# EAGLE board Schaltplan V1.0 (EAGLE 9.6.2)
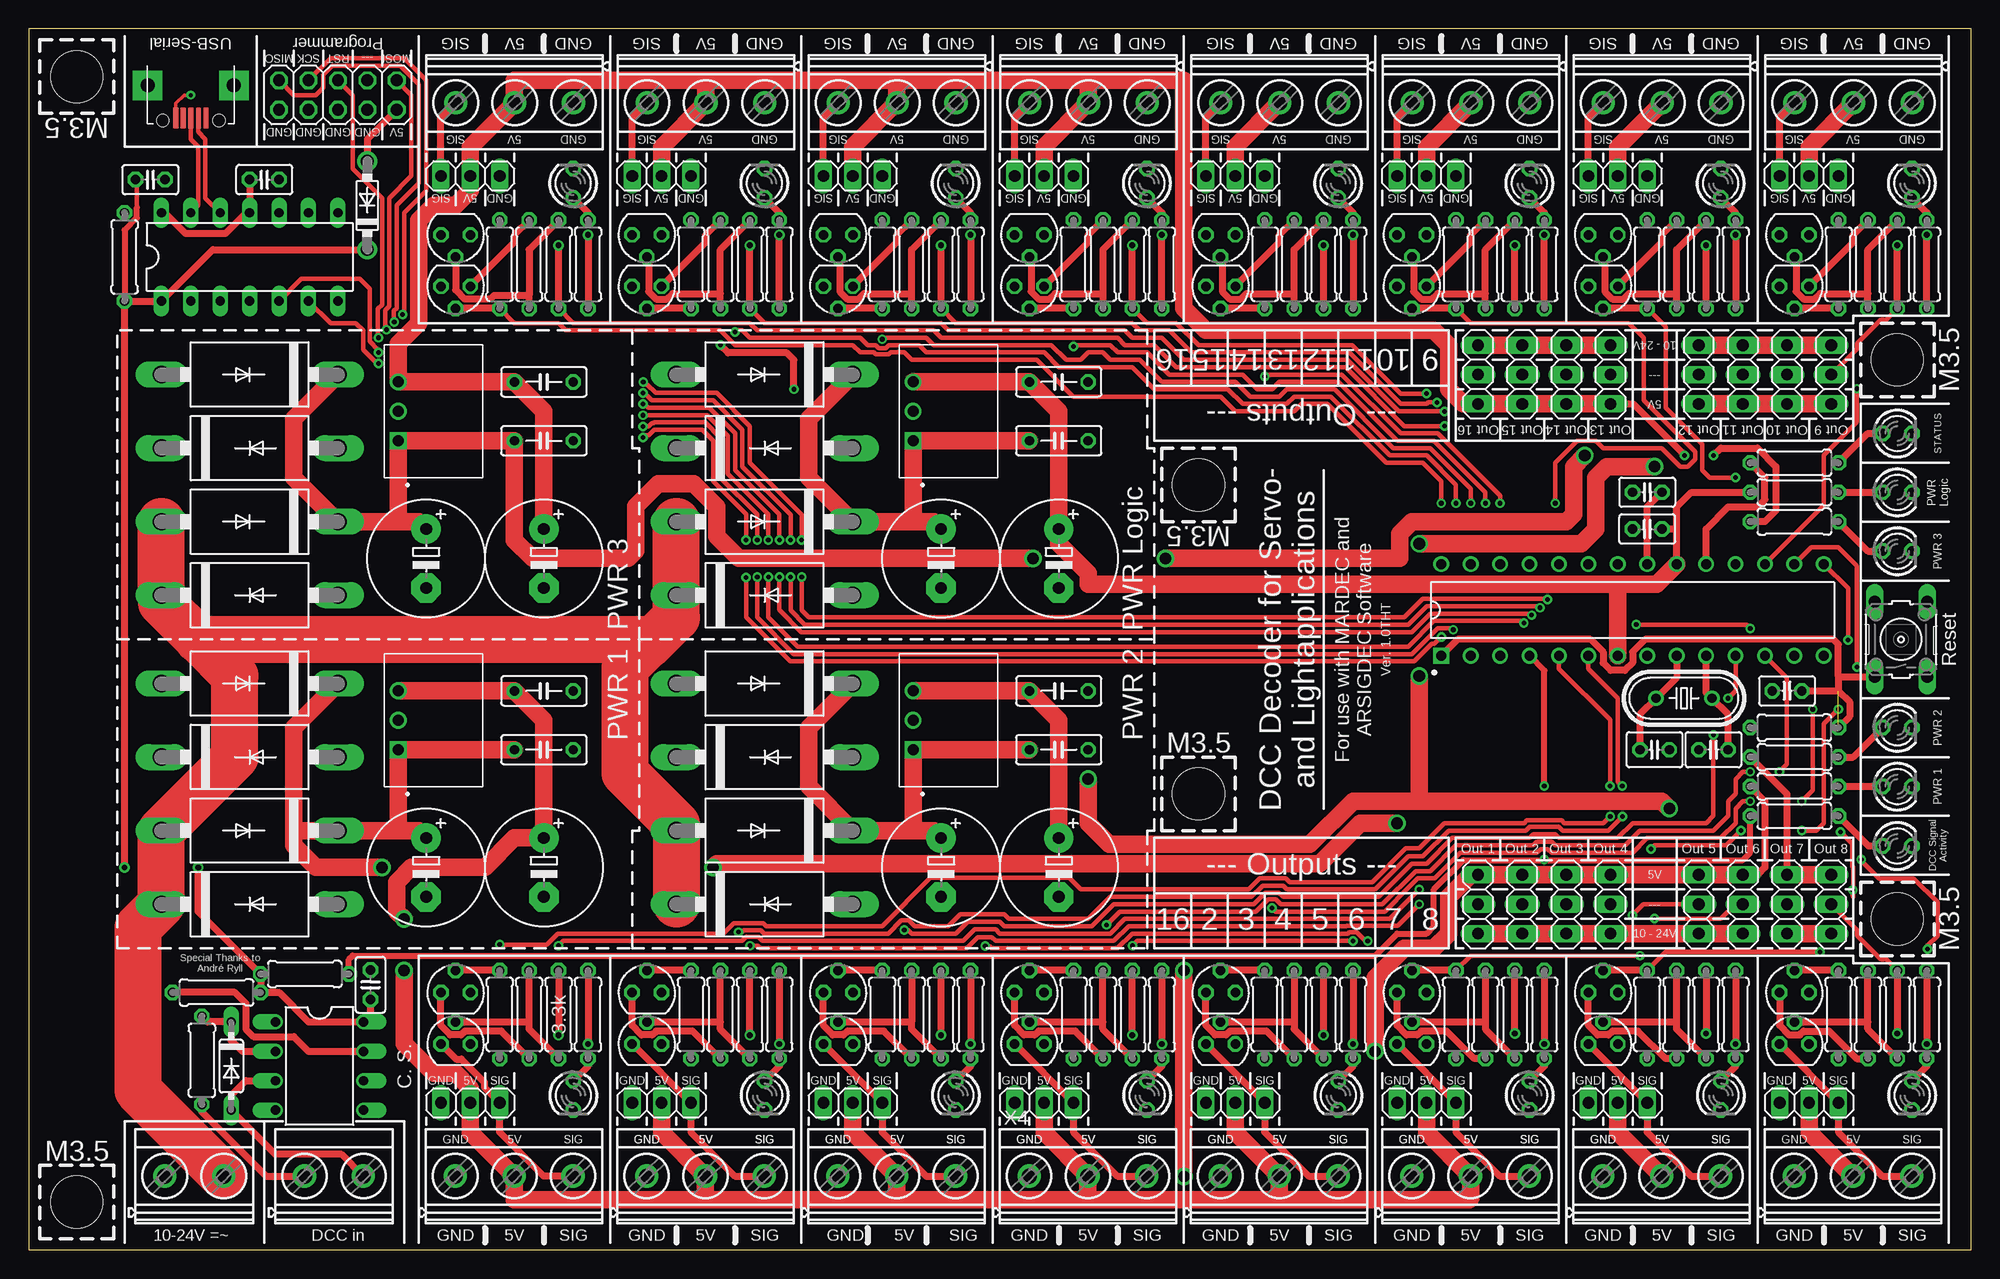
[diagram p1: board, top side]
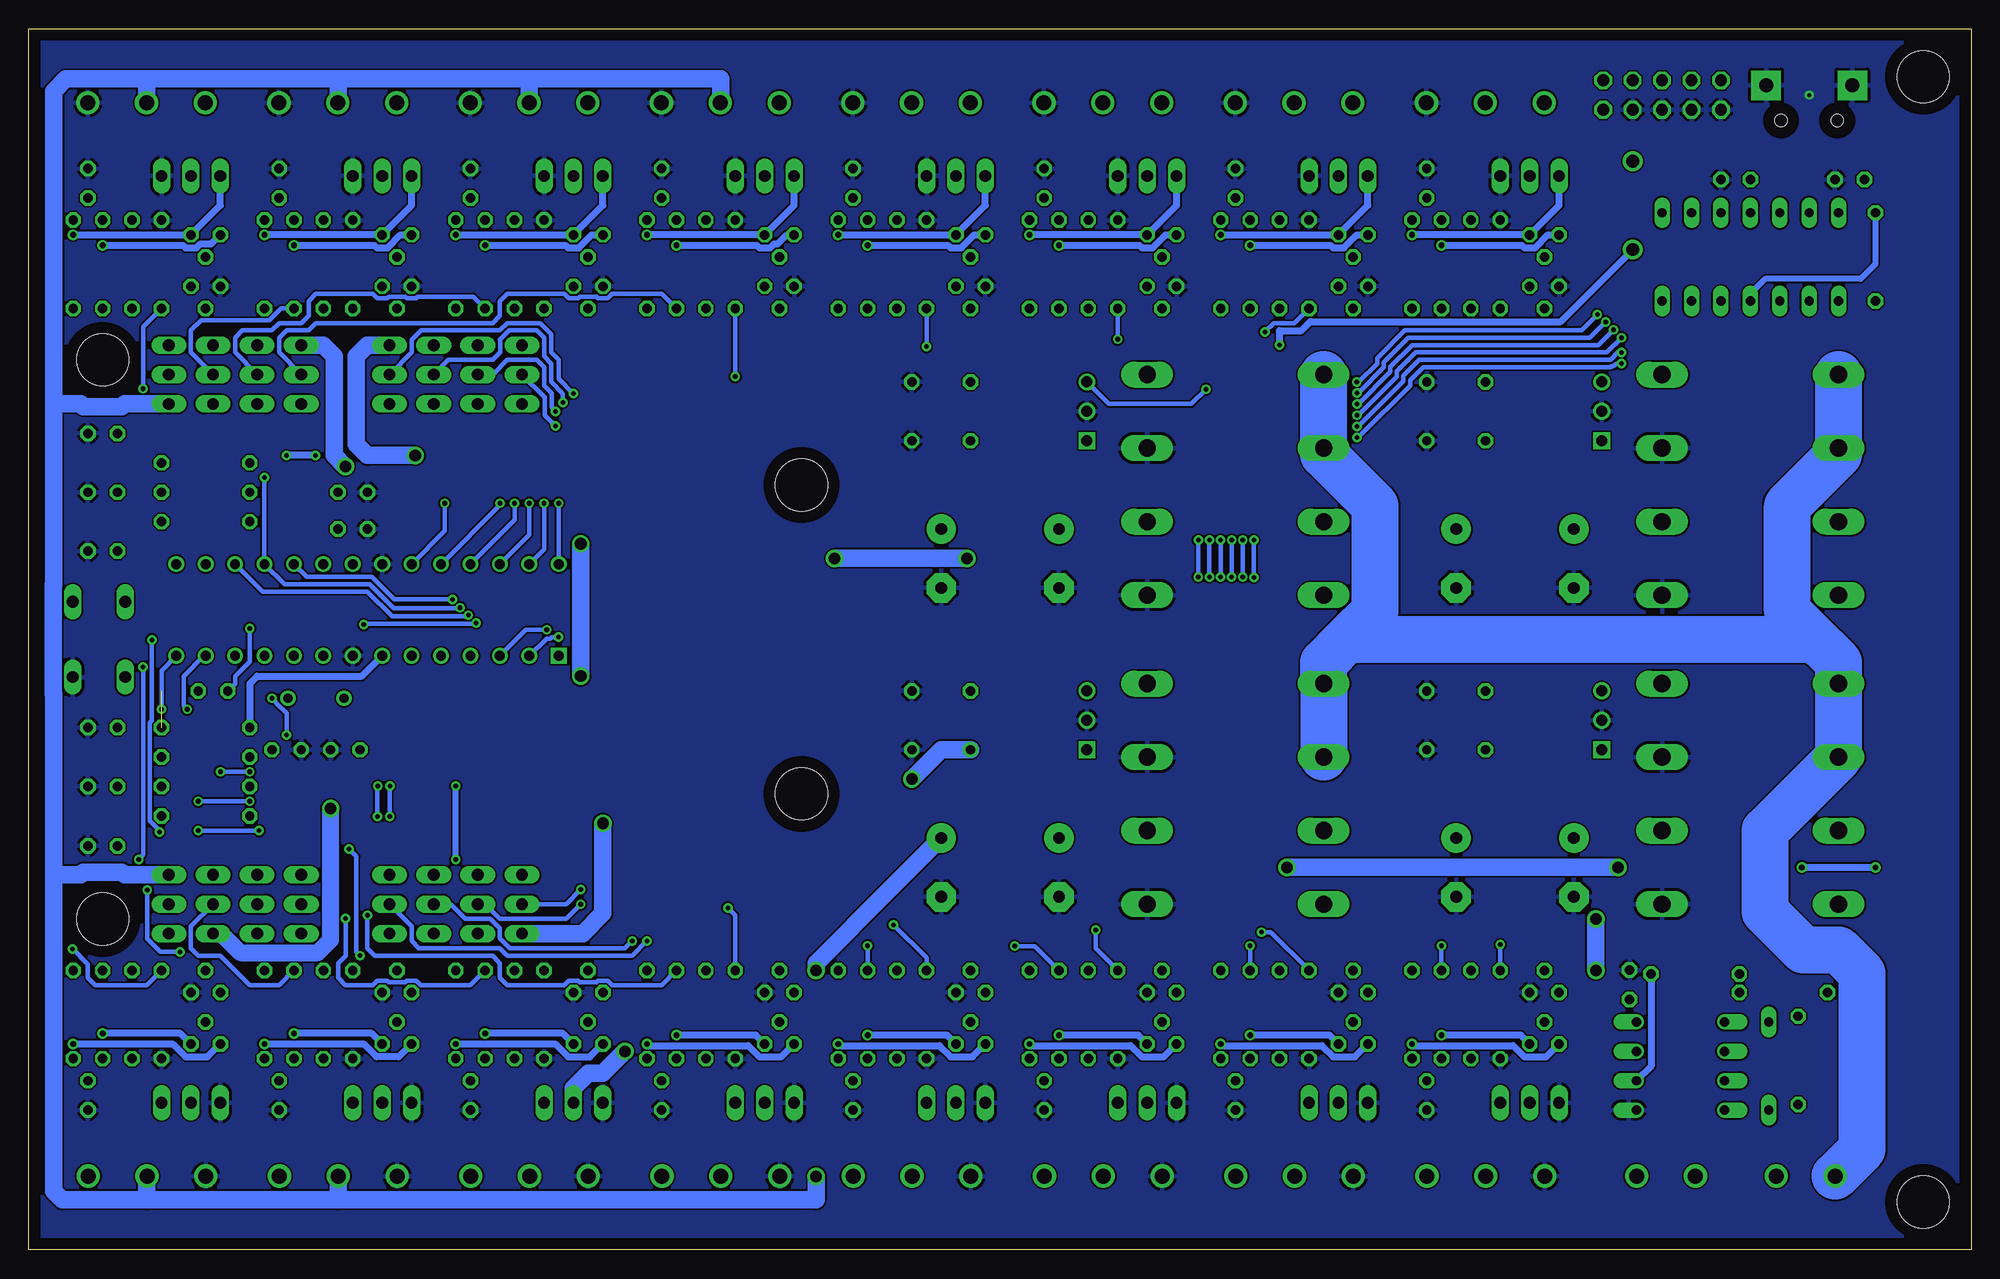
[diagram p2: board, bottom side, seen from below]

Size 167.65 x 105.4 mm. Coordinates in mm from the lower left corner, seen from the top.
Outline: 0,0 167.65,0 167.65,105.4 0,105.4 0,0
Copper layers (1*16): Top 0.07mm / dielectric 0.4mm / Bottom 0.07mm
Design rules "default *": minimum track width 6mil, minimum drill 0.35mm, track to track 6mil, track to pad 6mil, pad to pad 6mil, via to via 6mil, smd to smd 6mil, copper to edge 40mil, drill to drill 6mil, minimum pad ring 10mil, minimum via ring 8mil, stop-mask expansion 4mil, vias tented up to drill 0mil, thermal gap 10mil
Holes 4.5 mm at 161.29,76.83 161.29,28.57 100.96,39.37 100.96,66.04 4.13,101.28 4.13,4.13

## Footprints (pad centres in the part's own frame; a part is rotated, then mirrored left to right if it is on the bottom)
0207/7 = drill 0.813 octagon: 1 -3.81,0; 2 3.81,0
C050-025X075 = drill 0.813 octagon: 1 -2.54,0; 2 2.54,0
C025-025X050 = drill 0.813 octagon: 1 -1.27,0; 2 1.27,0
C025-030X050 = drill 0.813 octagon: 1 -1.27,0; 2 1.27,0
E5-10,5 = drill 1.016 pad 2.54: + -2.54,0 | drill 1.016 pad 2.54 octagon: - 2.54,0
DO201-15 = drill 1.499 long: A 7.62,0; C -7.62,0
DO35-7 = drill 0.813 long: A 3.81,0; C -3.81,0
DO41-7.6 = drill 1.1 pad 1.7: A 3.81,0; C -3.81,0
MKDSN1,5/2-5,08 = drill 1.3 pad 2: 1 -2.561,0.025; 2 2.519,0.025
DIL14 = drill 0.813 long: 1 -7.62,-3.81; 2 -5.08,-3.81; 3 -2.54,-3.81; 4 0,-3.81; 5 2.54,-3.81; 6 5.08,-3.81; 7 7.62,-3.81; 8 7.62,3.81; 9 5.08,3.81; 10 2.54,3.81; 11 0,3.81; 12 -2.54,3.81; 13 -5.08,3.81; 14 -7.62,3.81
1X03 = drill 1.016 long: 1 -2.54,0; 2 0,0; 3 2.54,0
LED3MM = drill 0.813 octagon: A -1.27,0; K 1.27,0
DIL08 = drill 0.813 offset: 1 -3.81,-3.81; 2 -1.27,-3.81; 3 1.27,-3.81; 4 3.81,-3.81; 5 3.81,3.81; 6 1.27,3.81; 7 -1.27,3.81; 8 -3.81,3.81
2X05 = drill 1.016 octagon: 1 -5.08,-1.27; 2 -5.08,1.27; 3 -2.54,-1.27; 4 -2.54,1.27; 5 0,-1.27; 6 0,1.27; 7 2.54,-1.27; 8 2.54,1.27; 9 5.08,-1.27; 10 5.08,1.27
CONV_R-78B5.0-2.0 = drill 0.94 square: 1 -2.54,3.05 | drill 0.94: 2 0,3.05; 3 2.54,3.05
HC49U-V = drill 0.813: 1 -2.413,0; 2 2.413,0
SOT54E = drill 0.813 octagon: D -1.27,0; G 0,1.905; S 1.27,0
B3F-10XX = drill 1.016 long: 1 -3.251,2.261; 2 3.251,2.261; 3 -3.251,-2.261; 4 3.251,-2.261
DIP794W46P254L2967H457Q28B = drill 0.85 square: 1 -3.96,16.51 | drill 0.85: 2 -3.96,13.97; 3 -3.96,11.43; 4 -3.96,8.89; 5 -3.96,6.35; 6 -3.96,3.81; 7 -3.96,1.27; 8 -3.96,-1.27; 9 -3.96,-3.81; 10 -3.96,-6.35; 11 -3.96,-8.89; 12 -3.96,-11.43; 13 -3.96,-13.97; 14 -3.96,-16.51; 15 3.96,-16.51; 16 3.96,-13.97; 17 3.96,-11.43; 18 3.96,-8.89; 19 3.96,-6.35; 20 3.96,-3.81; 21 3.96,-1.27; 22 3.96,1.27; 23 3.96,3.81; 24 3.96,6.35; 25 3.96,8.89; 26 3.96,11.43; 27 3.96,13.97; 28 3.96,16.51
MICRO-USB = smd 0.4 x 1.75: 1 -1.3,4.525; 2 -0.65,4.525; 3 0,4.525; 4 0.65,4.525; 5 1.3,4.525 | drill 1.2 pad 2.54 square: GND1 -3.725,1.7; GND2 3.725,1.7 | hole 1.05: -2.425,4.73; 2.425,4.73
MKDSN1,5/3-5,08 = drill 1.3 pad 2: 1 -7.641,0.025; 2 -2.561,0.025; 3 2.519,0.025

## Placement (x,y rotation side)
3,3K  3.3k  [0207/7]  45.72,20.32 90 top
3,3K1  3.3k  [0207/7]  62.23,20.32 90 top
3,3K2  3.3k  [0207/7]  78.74,20.32 90 top
3,3K3  3.3k  [0207/7]  95.25,20.32 90 top
3,3K4  3.3k  [0207/7]  111.76,20.32 90 top
3,3K5  3.3k  [0207/7]  128.27,20.32 90 top
3,3K6  3.3k  [0207/7]  144.78,20.32 90 top
3,3K7  3.3k  [0207/7]  161.29,20.32 90 top
3,3K8  3.3k  [0207/7]  161.29,85.09 270 top
3,3K9  3.3k  [0207/7]  144.78,85.09 270 top
3,3K10  3.3k  [0207/7]  128.27,85.09 270 top
3,3K11  3.3k  [0207/7]  111.76,85.09 270 top
3,3K12  3.3k  [0207/7]  95.25,85.09 270 top
3,3K13  3.3k  [0207/7]  78.74,85.09 270 top
3,3K14  3.3k  [0207/7]  62.23,85.09 270 top
3,3K15  3.3k  [0207/7]  45.72,85.09 270 top
C1  1uF  [C050-025X075]  44.45,48.26 180 top
C2  1uF  [C050-025X075]  44.45,43.18 180 top
C3  100nF  [C025-025X050]  29.48,22.89 90 top
C4  1uF  [C050-025X075]  88.9,48.26 180 top
C5  1uF  [C050-025X075]  88.9,43.18 180 top
C6  1uF  [C050-025X075]  44.45,74.93 180 top
C7  1uF  [C050-025X075]  44.45,69.85 180 top
C8  1uF  [C050-025X075]  88.9,74.93 180 top
C9  1uF  [C050-025X075]  88.9,69.85 180 top
C10  100nF  [C025-025X050]  151.76,48.26 0 top
C11  100nF  [C025-025X050]  139.7,65.41 0 top
C12  330nF  [C025-025X050]  20.32,92.39 180 top
C13  100nF  [C025-025X050]  10.48,92.39 0 top
C14  22pF  [C025-030X050]  145.41,43.18 0 top
C15  22pF  [C025-030X050]  140.34,43.18 180 top
C16  470uF  [E5-10,5]  78.74,59.69 270 top
C17  470uF  [E5-10,5]  88.9,59.69 270 top
C18  470uF  [E5-10,5]  44.45,33.02 270 top
C19  470uF  [E5-10,5]  88.9,33.02 270 top
C20  470uF  [E5-10,5]  34.29,33.02 270 top
C21  470uF  [E5-10,5]  78.74,33.02 270 top
C22  470uF  [E5-10,5]  44.45,59.69 270 top
C23  470uF  [E5-10,5]  34.29,59.69 270 top
C24  100nF  [C025-025X050]  139.7,62.23 180 top
D1  1N5400  [DO201-15]  19.05,48.89 180 top
D2  1N5400  [DO201-15]  19.05,42.54 0 top
D3  1N5400  [DO201-15]  19.05,36.2 180 top
D4  1N5400  [DO201-15]  19.05,29.85 0 top
D5  1N4148  [DO35-7]  17.46,15.88 270 top
D6  1N5400  [DO201-15]  63.5,36.2 180 top
D7  1N5400  [DO201-15]  63.5,29.85 0 top
D8  1N5400  [DO201-15]  63.5,48.89 180 top
D9  1N5400  [DO201-15]  63.5,42.54 0 top
D10  1N5400  [DO201-15]  19.05,75.56 180 top
D11  1N5400  [DO201-15]  19.05,69.22 0 top
D12  1N5400  [DO201-15]  19.05,62.86 180 top
D13  1N5400  [DO201-15]  19.05,56.52 0 top
D14  1N5400  [DO201-15]  63.5,75.56 180 top
D15  1N5400  [DO201-15]  63.5,69.22 0 top
D16  1N5400  [DO201-15]  63.5,62.86 180 top
D17  1N5400  [DO201-15]  63.5,56.52 0 top
D19  1N5817-B  [DO41-7.6]  29.21,90.17 90 top
DCC_IN  [MKDSN1,5/2-5,08]  26.35,6.35 0 top
IC1  MCP2221  [DIL14]  19.05,85.72 0 top
JP1  [1X03]  54.61,12.7 0 top
JP2  [1X03]  128.91,29.85 90 top
JP3  [1X03]  38.1,12.7 0 top
JP4  [1X03]  125.09,29.85 90 top
JP5  [1X03]  71.12,12.7 0 top
JP6  [1X03]  132.72,29.85 90 top
JP7  [1X03]  87.63,12.7 0 top
JP8  [1X03]  136.53,29.85 90 top
JP9  [1X03]  104.14,12.7 0 top
JP10  [1X03]  144.14,29.85 90 top
JP11  [1X03]  120.65,12.7 0 top
JP12  [1X03]  147.95,29.85 90 top
JP13  [1X03]  137.16,12.7 0 top
JP14  [1X03]  151.76,29.85 90 top
JP15  [1X03]  153.67,12.7 0 top
JP16  [1X03]  155.57,29.85 90 top
JP17  [1X03]  153.67,92.71 180 top
JP18  [1X03]  155.57,75.56 270 top
JP19  [1X03]  137.16,92.71 180 top
JP20  [1X03]  151.76,75.56 270 top
JP21  [1X03]  120.65,92.71 180 top
JP22  [1X03]  147.95,75.56 270 top
JP23  [1X03]  104.14,92.71 180 top
JP24  [1X03]  144.14,75.56 270 top
JP25  [1X03]  87.63,92.71 180 top
JP26  [1X03]  136.53,75.56 270 top
JP27  [1X03]  71.12,92.71 180 top
JP28  [1X03]  132.72,75.56 270 top
JP29  [1X03]  54.61,92.71 180 top
JP30  [1X03]  128.91,75.56 270 top
JP31  [1X03]  38.1,92.71 180 top
JP32  [1X03]  125.09,75.56 270 top
LED1  ROT  [LED3MM]  161.29,40 0 top
LED2  ROT  [LED3MM]  46.99,13.34 270 top
LED3  ROT  [LED3MM]  63.5,13.34 270 top
LED4  ROT  [LED3MM]  80.01,13.34 270 top
LED5  ROT  [LED3MM]  96.52,13.34 270 top
LED6  ROT  [LED3MM]  113.03,13.34 270 top
LED7  ROT  [LED3MM]  129.54,13.34 270 top
LED8  ROT  [LED3MM]  146.05,13.34 270 top
LED9  ROT  [LED3MM]  162.56,13.34 270 top
LED10  ROT  [LED3MM]  162.56,92.08 90 top
LED11  ROT  [LED3MM]  146.05,92.08 90 top
LED12  ROT  [LED3MM]  129.54,92.08 90 top
LED13  ROT  [LED3MM]  113.03,92.08 90 top
LED14  ROT  [LED3MM]  96.52,92.08 90 top
LED15  ROT  [LED3MM]  80.01,92.08 90 top
LED16  ROT  [LED3MM]  63.5,92.08 90 top
LED17  ROT  [LED3MM]  46.99,92.08 90 top
LED18  ROT  [LED3MM]  161.29,45.08 0 top
LED19  ROT  [LED3MM]  161.29,60.32 0 top
LED20  ROT  [LED3MM]  161.29,65.41 0 top
LED21  GRÜN  [LED3MM]  161.29,70.48 0 top
LED22  GELB  [LED3MM]  161.29,34.88 0 top
OK1  6N137  [DIL08]  25.08,15.88 270 top
POWER_IN  10-24V  [MKDSN1,5/2-5,08]  14.29,6.35 0 top
PRG_HEADER  [2X05]  26.67,99.69 180 top
PS1  R-78B5.0-2.0  [CONV_R-78B5.0-2.0]  79.38,72.39 90 top
PS2  R-78B5.0-2.0  [CONV_R-78B5.0-2.0]  34.92,45.72 90 top
PS3  R-78B5.0-2.0  [CONV_R-78B5.0-2.0]  79.38,45.72 90 top
PS4  R-78B5.0-2.0  [CONV_R-78B5.0-2.0]  34.92,72.39 90 top
Q1  16Mhz  [HC49U-V]  142.88,47.62 180 top
Q2  BS170  [SOT54E]  36.83,22.23 0 top
Q3  BS250  [SOT54E]  36.83,17.78 0 top
Q4  BS170  [SOT54E]  53.34,22.23 0 top
Q5  BS250  [SOT54E]  53.34,17.78 0 top
Q6  BS170  [SOT54E]  69.85,22.23 0 top
Q7  BS250  [SOT54E]  69.85,17.78 0 top
Q8  BS170  [SOT54E]  86.36,22.23 0 top
Q9  BS250  [SOT54E]  86.36,17.78 0 top
Q10  BS170  [SOT54E]  102.87,22.23 0 top
Q11  BS250  [SOT54E]  102.87,17.78 0 top
Q12  BS170  [SOT54E]  119.38,22.23 0 top
Q13  BS250  [SOT54E]  119.38,17.78 0 top
Q14  BS170  [SOT54E]  135.89,22.23 0 top
Q15  BS250  [SOT54E]  135.89,17.78 0 top
Q16  BS170  [SOT54E]  152.4,22.23 0 top
Q17  BS250  [SOT54E]  152.4,17.78 0 top
Q18  BS170  [SOT54E]  152.4,83.19 180 top
Q19  BS250  [SOT54E]  152.4,87.63 180 top
Q20  BS170  [SOT54E]  135.89,83.19 180 top
Q21  BS250  [SOT54E]  135.89,87.63 180 top
Q22  BS170  [SOT54E]  119.38,83.19 180 top
Q23  BS250  [SOT54E]  119.38,87.63 180 top
Q24  BS170  [SOT54E]  102.87,83.19 180 top
Q25  BS250  [SOT54E]  102.87,87.63 180 top
Q26  BS170  [SOT54E]  86.36,83.19 180 top
Q27  BS250  [SOT54E]  86.36,87.63 180 top
Q28  BS170  [SOT54E]  69.85,83.19 180 top
Q29  BS250  [SOT54E]  69.85,87.63 180 top
Q30  BS170  [SOT54E]  53.34,83.19 180 top
Q31  BS250  [SOT54E]  53.34,87.63 180 top
Q32  BS170  [SOT54E]  36.83,83.19 180 top
Q33  BS250  [SOT54E]  36.83,87.63 180 top
R1  10k  [0207/7]  16.19,22.23 0 top
R2  10k  [0207/7]  23.81,23.81 180 top
R3  1.5k  [0207/7]  14.92,16.36 90 top
R4  220  [0207/7]  152.4,40 180 top
R5  1.5k  [0207/7]  48.26,20.32 90 top
R6  1.5k  [0207/7]  64.77,20.32 90 top
R7  10k  [0207/7]  59.69,20.32 90 top
R8  10k  [0207/7]  57.15,20.32 90 top
R9  1.5k  [0207/7]  81.28,20.32 90 top
R10  10k  [0207/7]  76.2,20.32 90 top
R11  10k  [0207/7]  73.66,20.32 90 top
R12  1.5k  [0207/7]  97.79,20.32 90 top
R13  10k  [0207/7]  92.71,20.32 90 top
R14  10k  [0207/7]  90.17,20.32 90 top
R15  1.5k  [0207/7]  114.3,20.32 90 top
R16  10k  [0207/7]  109.22,20.32 90 top
R17  10k  [0207/7]  106.68,20.32 90 top
R18  1.5k  [0207/7]  130.81,20.32 90 top
R19  10k  [0207/7]  125.73,20.32 90 top
R20  10k  [0207/7]  123.19,20.32 90 top
R21  220  [0207/7]  152.4,42.54 180 top
R22  220  [0207/7]  152.4,62.86 180 top
R23  1.5k  [0207/7]  147.32,20.32 90 top
R24  10k  [0207/7]  142.24,20.32 90 top
R25  10k  [0207/7]  139.7,20.32 90 top
R26  1.5k  [0207/7]  163.83,20.32 90 top
R27  10k  [0207/7]  158.75,20.32 90 top
R28  10k  [0207/7]  156.21,20.32 90 top
R29  1.5k  [0207/7]  163.83,85.09 270 top
R30  10k  [0207/7]  158.75,85.09 270 top
R31  10k  [0207/7]  156.21,85.09 270 top
R32  1.5k  [0207/7]  147.32,85.09 270 top
R33  10k  [0207/7]  142.24,85.09 270 top
R34  10k  [0207/7]  139.7,85.09 270 top
R35  1.5k  [0207/7]  130.81,85.09 270 top
R36  10k  [0207/7]  125.73,85.09 270 top
R37  10k  [0207/7]  123.19,85.09 270 top
R38  1.5k  [0207/7]  114.3,85.09 270 top
R39  10k  [0207/7]  152.4,45.08 0 top
R40  220  [0207/7]  152.4,65.41 180 top
R41  220  [0207/7]  152.4,67.94 180 top
R42  220  [0207/7]  152.4,37.46 180 top
R43  10k  [0207/7]  8.25,85.72 270 top
R44  10k  [0207/7]  43.18,20.32 90 top
R45  10k  [0207/7]  109.22,85.09 270 top
R46  10k  [0207/7]  40.64,20.32 90 top
R47  10k  [0207/7]  106.68,85.09 270 top
R48  1.5k  [0207/7]  97.79,85.09 270 top
R49  10k  [0207/7]  92.71,85.09 270 top
R50  10k  [0207/7]  90.17,85.09 270 top
R51  1.5k  [0207/7]  81.28,85.09 270 top
R52  10k  [0207/7]  76.2,85.09 270 top
R53  10k  [0207/7]  73.66,85.09 270 top
R54  1.5k  [0207/7]  64.77,85.09 270 top
R55  10k  [0207/7]  59.69,85.09 270 top
R56  10k  [0207/7]  57.15,85.09 270 top
R57  1.5k  [0207/7]  48.26,85.09 270 top
R58  10k  [0207/7]  43.18,85.09 270 top
R59  10k  [0207/7]  40.64,85.09 270 top
S1  FP: B3F-10XX  [B3F-10XX]  161.61,52.7 90 top
U1  ATMEGA328P-PU  [DIP794W46P254L2967H457Q28B]  138.43,55.24 90 top
U$1  MICRO-USB  [MICRO-USB]  13.97,102.23 180 top
X1  [MKDSN1,5/3-5,08]  60.96,6.35 0 top
X2  [MKDSN1,5/3-5,08]  44.45,6.35 0 top
X3  [MKDSN1,5/3-5,08]  77.47,6.35 0 top
X4  [MKDSN1,5/3-5,08]  93.98,6.35 0 top
X5  [MKDSN1,5/3-5,08]  110.49,6.35 0 top
X6  [MKDSN1,5/3-5,08]  127,6.35 0 top
X7  [MKDSN1,5/3-5,08]  143.51,6.35 0 top
X8  [MKDSN1,5/3-5,08]  160.02,6.35 0 top
X9  [MKDSN1,5/3-5,08]  154.94,99.06 180 top
X10  [MKDSN1,5/3-5,08]  138.43,99.06 180 top
X11  [MKDSN1,5/3-5,08]  121.92,99.06 180 top
X12  [MKDSN1,5/3-5,08]  105.41,99.06 180 top
X13  [MKDSN1,5/3-5,08]  88.9,99.06 180 top
X14  [MKDSN1,5/3-5,08]  72.39,99.06 180 top
X15  [MKDSN1,5/3-5,08]  55.88,99.06 180 top
X16  [MKDSN1,5/3-5,08]  39.37,99.06 180 top

## Tracks (layer width: path | path; a pad name or v marks a point on that pad's centre or on a via)
5V_1  (via drill 1)
  Top 0.61: R4.2 149.86,38.73 149.86,33.02 149.22,32.38 JP12.3
  Top 1.524: 58.42,4.32 41.89,4.32 X2.2 38.1,10.16 JP3.2 38.1,13.97 36.83,15.24 34.92,15.24 32.38,17.78 v32.38,24.13 | 58.42,4.32 74.93,4.32 | 74.93,4.32 91.44,4.32 | 74.93,4.32 74.91,4.34 X3.2 71.12,10.16 JP5.2 | PS2.3 C1.2 44.45,45.72 C18.+ 41.91,35.56 39.37,33.02 33.02,33.02 31.75,31.75 31.75,29.21 v32.38,28.57 | 107.95,4.32 91.44,4.32 | 107.95,4.32 124.33,4.32 124.46,4.45 124.46,6.35 X6.2 120.65,10.16 JP11.2 | 107.95,4.32 107.93,4.34 X5.2 104.14,10.16 JP9.2 | 58.42,4.32 58.4,4.34 X1.2 54.61,10.16 JP1.2 | JP7.2 87.63,10.16 X4.2 91.42,4.34 91.44,4.32 | JP12.3 JP10.3 JP8.3 JP6.3 JP2.3 JP4.3 124.46,32.38 122.55,30.48 122.55,27.3 121.28,26.04 118.74,26.04 116.2,23.5 v116.2,17.14
  Bottom 1.524: JP11.2 120.65,13.97 119.38,15.24 118.11,15.24 v116.2,17.14 | v32.38,24.13 v32.38,28.57
5V_2  (via drill 1)
  Top 0.61: R21.2 151.76,39.37 JP14.3
  Top 1.524: PS3.3 C4.2 88.9,45.72 C19.+ | X12.2 107.95,99.06 104.14,95.25 JP23.2 | v99.69,24.13 v99.69,6.35 | JP21.2 120.65,95.2 X11.2 | JP19.2 137.16,95.2 X10.2 | JP14.3 JP16.3 | JP18.3 JP20.3 JP22.3 JP24.3 | X7.2 137.16,10.16 JP13.2 | X8.2 153.67,10.16 JP15.2 | JP17.2 153.67,95.2 X9.2
  Bottom 1.524: v99.69,6.35 99.69,4.32 140.97,4.32 | v99.69,24.13 99.69,24.77 93.34,31.12 C19.+ | 140.97,4.32 140.97,6.35 X7.2 | X8.2 157.48,6.35 157.48,4.32 | X12.2 107.95,99.06 107.95,101.08 124.46,101.08 | 165.53,73.02 165.53,100.02 164.47,101.08 157.48,101.08 | 165.53,32.38 165.53,47.98 165.54,48 165.54,57.41 165.53,57.42 165.53,73.02 | 165.53,32.38 165.53,5.08 164.77,4.32 157.48,4.32 | 157.48,101.08 140.97,101.08 | 140.97,101.08 124.46,101.08 | X10.2 140.97,99.06 140.97,101.08 | JP16.3 159.4,32.38 159.62,32.6 162.96,32.6 163.18,32.38 165.53,32.38 | JP18.3 159.4,73.02 159.62,72.81 162.96,72.81 163.18,73.02 165.53,73.02 | X9.2 157.5,101.06 157.48,101.08 | 140.97,4.32 157.48,4.32 | X11.2 124.46,99.06 124.46,101.08
5V_3  (via drill 0.4)
  Top 0.61: R22.2 149.86,62.86 150.81,63.82 150.81,67.63 149.22,69.22 146.05,69.22 v145.41,68.58 | JP26.3 138.48,73.02 v142.92,68.58
  Top 1.524: X13.2 91.44,99.06 | 91.44,99.06 91.44,100.97 | 91.44,100.97 74.93,100.97 | 74.93,100.97 58.42,100.97 | 58.42,100.97 41.91,100.97 41.91,99.06 X16.2 38.1,95.2 JP31.2 38.1,91.44 36.83,90.17 34.92,90.17 33.66,88.9 33.66,80.01 31.88,78.23 PS4.3 C6.2 44.45,72.39 C22.+ | 58.42,100.97 58.42,99.06 X15.2 54.61,95.2 JP29.2 | X14.2 74.93,99.06 | 74.93,99.06 74.93,100.97 | JP27.2 71.12,95.25 74.93,99.06 | JP25.2 87.63,95.25 91.44,99.06 | 91.44,100.97 99.69,100.97 99.69,81.28 101.6,79.38 121.28,79.38 122.55,78.11 122.55,75.25 122.55,74.3 123.82,73.02 JP32.3 JP30.3 JP28.3 JP26.3
  Bottom 0.61: v142.92,68.58 v145.41,68.58
5V_LOGIC  (via drill 0.4, 0.5)
  Top 0.406: 9.32,89.98 9.32,92.28 C13.1
  Top 0.508: 9.32,89.98 9.32,89.09 8.25,88.03 R43.2
  Top 0.61: C3.1 29.48,20.28 OK1.8 24.13,19.69 21.59,22.23 R1.2 R2.2 14.61,29.21 v14.61,33.02 | D19.C 15.88,86.36 IC1.1 R43.2 v8.25,33.02 | U1.20 142.24,62.23 | 142.24,62.23 142.24,64.14 143.51,65.41 R40.2 | 142.24,62.23 C24.1 | v66.04,74.3 66.04,76.83 65.43,77.44 60.35,77.44 v59.69,78.11
  Top 1.524: PS1.3 C8.2 88.9,72.39 C17.+ 88.9,60.96 91.44,58.42 91.44,57.47 137.16,57.47 | U1.7 137.16,57.47 | 137.16,57.47 140.5,57.47 U1.20
  Bottom 0.406: PS1.3 74.42,73.02 67.31,73.02 v66.04,74.3
  Bottom 0.61: R39.1 148.59,48.89 147.95,49.53 138.91,49.53 U1.7 | D19.C 35.43,80.14 57.02,80.14 57.81,79.35 59.69,79.35 v59.69,78.11 | v14.61,33.02 v8.25,33.02
10-24V_1  (via drill 1)
  Top 1.524: D1.C 22.86,45.08 22.86,36.2 | C2.2 PS2.1 31.88,36.32 31.75,36.2 | 31.75,36.2 D3.C 22.86,36.2 | 31.75,36.2 33.66,36.2 C20.+ | 22.86,36.2 22.86,34.92 24.77,33.02 v30.48,33.02 | JP4.1 JP2.1 JP6.1 JP8.1 JP10.1 JP12.1 | v59.05,33.02 59.37,33.34 111.44,33.34 114.93,36.83 v118.11,36.83
  Bottom 1.524: JP4.1 119.85,27.3 118.11,29.05 v118.11,36.83 | v30.48,33.02 v59.05,33.02
10-24V_2  (via drill 1)
  Top 1.524: D8.C 67.31,45.08 67.31,40 D6.C 76.2,36.2 | C5.2 PS3.1 76.32,36.32 76.2,36.2 | 76.2,36.2 78.1,36.2 C21.+ | JP14.1 JP16.1 | JP18.1 JP20.1 JP22.1 JP24.1 | v120.02,60.96 133.99,60.96 135.25,62.23 135.25,66.67 136.21,67.63 v140.34,67.63 | v91.44,40.64 91.44,36.83 93.26,35.01 110.58,35.01 114.3,38.73 120.02,38.73 | v141.6,38.1 140.97,38.73 120.02,38.73 | v120.02,49.53 120.02,38.73
  Bottom 1.448: JP14.1 151.03,27.3 149.4,25.67 142.7,25.67 141.6,26.77 v141.6,38.1
  Bottom 1.524: v120.02,49.53 v120.02,60.96 | v140.34,67.63 141.29,68.58 141.29,77.15 142.24,78.11 JP24.1 | C5.2 88.9,43.18 v91.44,40.64
10-24V_3  (via drill 1)
  Top 1.524: D10.C 22.86,71.75 22.86,66.67 D12.C 31.75,62.86 | 31.75,62.86 33.66,62.86 C23.+ | 31.75,62.86 31.88,62.99 PS4.1 C7.2 41.91,61.28 43.5,59.69 51.75,59.69 52.4,60.34 52.4,64.19 54.34,66.13 57.38,66.13 59.37,64.14 59.37,61.59 61.28,59.69 v86.68,59.69 | JP32.1 JP30.1 JP28.1 JP26.1 | v98.11,59.69 118.34,59.69 118.34,61.82 119.38,62.86 132.72,62.86 133.35,63.5 133.35,67.63 v134.3,68.58
  Bottom 1.524: v86.68,59.69 v98.11,59.69 | v134.3,68.58 138.43,68.58 139.38,69.53 139.38,77.15 138.43,78.11 JP26.1
10-24V_LOGIC
  Top 1.524: D14.C 67.31,71.75 67.31,66.67 D16.C 76.2,62.86 | 76.2,62.86 78.1,62.86 C16.+ | 76.2,62.86 76.32,62.99 PS1.1 C9.2
AREF
  Top 0.61: C11.2 139.7,64.14 U1.21
DCC_SIG  (via drill 0.4)
  Top 0.508: R2.1 27.62,25.08 27.94,25.4 116.2,25.4 118.11,27.3 120.65,27.3 121.28,27.94 121.28,31.12 123.82,33.66 130.81,33.66 | 130.81,33.66 147.95,33.66 148.59,34.29 R42.2 | 130.81,33.66 v130.81,33.7 | v130.81,40.05 130.81,50.02 U1.4
  Bottom 0.508: v130.81,33.7 v130.81,40.05
  Bottom 0.61: R2.1 27.62,15.88 OK1.6
GND  (via drill 0.35)
  Top 0.305: U$1.5 12.67,98.98 13.38,99.69 v13.97,99.69
  pour Bottom: -9.53,110.49 -9.53,3.17 0.63,-6.99 168.28,-6.99 175.26,0 175.26,104.14 164.47,114.94 -5.08,114.94
MOD_1  (via drill 0.4)
  Top 0.406: v40.64,26.35 44.7,26.35 45.66,27.3 59.94,27.3 60.83,28.19 63.37,28.19 63.63,27.94 73.66,27.94 77.83,32.11 89.81,32.11 90.8,31.12 105.28,31.12 106.26,32.09 108.5,32.09 108.84,31.75 115.95,31.75 118.87,34.67 120.02,34.67 122.17,36.83 129.07,36.83 129.31,37.07 132.31,37.07 132.55,36.83 135.91,36.83 v136.5,37.42 | U1.5 132.08,50.16 136.5,45.74 v136.5,40.05
  Top 0.61: R46.2 Q2.G
  Bottom 0.406: R46.2 v40.64,26.35 | v136.5,37.42 v136.5,40.05
MOD_2  (via drill 0.4)
  Top 0.406: v137.58,37.42 136.35,36.2 132.4,36.2 132.08,36.51 129.54,36.51 129.22,36.2 122.55,36.2 120.33,33.97 119.06,33.97 116.2,31.12 108.58,31.12 108.27,31.43 106.49,31.43 105.54,30.48 93.34,30.48 91.44,28.57 84.58,28.57 84.2,28.96 80.39,28.96 79.38,27.94 76.45,27.94 75.95,28.45 75.31,28.45 74.17,27.3 63.47,27.3 63.19,27.58 61.68,27.58 61.54,27.43 v61.25,27.43 | v137.54,40.05 137.16,40.43 137.16,47.62 134.62,50.16 U1.6
  Top 0.61: R8.2 Q4.G
  Bottom 0.406: R8.2 60.45,27.43 v61.25,27.43 | v137.58,37.42 137.58,40.02 v137.54,40.05
MOD_3  (via drill 0.4)
  Top 0.406: v75.56,27.62 75.88,27.62 76.2,27.3 80.01,27.3 81.03,28.32 83.82,28.32 84.2,27.94 91.76,27.94 93.66,29.85 105.73,29.85 106.73,30.85 107.9,30.85 108.27,30.48 116.52,30.48 119.38,33.34 120.65,33.34 122.87,35.56 129.54,35.56 129.86,35.88 131.76,35.88 132.08,35.56 137.16,35.56 138.43,36.83 144.78,36.83 145.41,37.46 v145.41,44.45 | v146.69,47.62 147.32,48.26 U1.11
  Top 0.61: R11.2 Q6.G
  Bottom 0.406: v75.56,27.62 75.56,26.04 R11.2 | v146.69,47.62 146.3,47.24 146.3,47.2 145.41,46.31 v145.41,44.45
MOD_4  (via drill 0.4)
  Top 0.406: v93.03,28.06 94.17,29.21 105.92,29.21 107,30.29 107.63,30.29 108.07,29.85 116.84,29.85 119.7,32.7 120.97,32.7 123.19,34.92 129.86,34.92 130.18,35.24 131.44,35.24 131.76,34.92 137.79,34.92 139.06,36.2 145.41,36.2 146.69,37.46 146.69,38.73 147.32,39.37 147.32,40.64 147.95,41.27 v148.59,41.27 | v151.13,41.27 151.76,41.91 151.76,49.38 U1.12
  Top 0.61: R14.2 Q8.G
  Bottom 0.406: R14.2 90.17,25.21 v93.03,28.06 | v148.59,41.27 v151.13,41.27
MOD_5  (via drill 0.4)
  Top 0.406: v107.31,29.53 107.63,29.21 117.03,29.21 119.13,31.31 119.13,31.3 119.89,32.07 121.34,32.07 123.56,34.29 130.18,34.29 130.49,34.61 131.13,34.61 131.44,34.29 138.43,34.29 139.7,35.56 146.05,35.56 147.32,36.83 147.32,38.1 147.95,38.73 v148.59,38.73 | v153.03,38.73 153.99,39.69 v153.99,46.67
  Top 0.61: R17.2 Q10.G
  Bottom 0.406: R17.2 106.68,28.89 v107.31,29.53 | v148.59,38.73 v153.03,38.73 | U1.13 152.55,51.28 154.31,49.53 154.31,46.99 v153.99,46.67
MOD_6  (via drill 0.4)
  Top 0.406: R20.2 124.46,25.4 v139.06,25.4 | v153.03,36.2 154.31,36.2 154.94,36.83 154.94,45.4 v156.21,46.67 | v140.02,34.61 140.34,34.92 146.51,34.92 v147.78,36.2
  Top 0.61: R20.2 Q12.G
  Bottom 0.406: v139.06,25.4 139.38,25.72 139.38,33.97 v140.02,34.61 | v147.78,36.2 v153.03,36.2 | U1.14 156.21,50.02 v156.21,46.67
MOD_7  (via drill 0.4)
  Top 0.406: v157.04,52.66 157.04,57.11 U1.15 | v157.44,31.07 157.44,30.52 157.48,30.48 157.48,33.02 157.42,33.08 157.42,35.04 v156.39,36.06 | v154.62,25.72 141.29,25.72 R25.2
  Top 0.61: R25.2 Q14.G
  Bottom 0.406: v157.44,31.07 157.44,30.32 157.45,30.31 157.45,26.84 156.33,25.72 v154.62,25.72 | v156.39,36.06 156.39,36.21 157.23,37.04 157.23,45.51 157.04,45.69 v157.04,52.66
MOD_8  (via drill 0.4)
  Top 0.406: U1.16 153.84,60.64 156.21,60.64 157.8,59.05 v157.8,50.31 | v163.88,25.98 163.88,26.26 164.76,27.14 164.76,30.01 162.73,32.04 159.73,32.04 158.17,33.59 v158.17,33.71
  Top 0.61: R28.2 Q16.G
  Bottom 0.406: v163.88,25.98 162.56,24.66 162.56,23.5 161.92,22.86 157.48,22.86 R28.2 | v158.17,33.71 157.8,34.09 v157.8,50.31
MOD_9/MOSI  (via drill 0.4)
  Top 0.406: PRG_HEADER.1 33.02,99.69 33.02,92.71 31.12,90.8 31.12,81.46 30.78,81.12 30.78,79.8 30.86,79.72 v30.86,79.43 | v53.02,73.01 53.22,72.81 53.34,72.81 53.44,72.71 58.74,72.71 60.96,70.48 60.96,67.31 64.78,63.49 v64.78,61.28 | v64.79,58.1 64.79,55.26 64.77,55.24 66.67,53.34 119.38,53.34 120.97,54.93 129.59,54.93 v129.72,54.79 | U1.17 154.94,64.28 154.94,68.58 157.8,71.44 v157.8,74.34
  Top 0.61: R31.2 Q18.G
  Bottom 0.406: v30.86,79.43 32.19,78.11 48.25,78.11 50.12,76.23 50.12,75.8 52.91,73.01 v53.02,73.01 | v64.78,61.28 v64.78,58.11 v64.79,58.1 | v129.72,54.79 129.84,54.68 136.28,54.68 138.43,56.83 147.49,56.83 U1.17 | R31.2 157.8,79.69 v157.8,74.34
MOD_10/MISO  (via drill 0.4)
  Top 0.406: PRG_HEADER.9 22.86,99.69 24.77,99.69 25.4,100.33 25.4,101.44 26.19,102.23 32.06,102.23 33.66,100.64 33.66,92.08 31.75,90.17 31.75,81.3 31.5,81.05 31.5,80.43 31.53,80.39 v31.53,80.11 | v53.02,73.97 53.22,73.77 53.34,73.77 53.77,73.34 59.05,73.34 61.59,70.8 61.59,67.63 65.74,63.48 v65.74,61.28 | v65.75,58.1 65.75,55.22 66.99,53.97 119.06,53.97 120.65,55.56 130.31,55.56 v130.44,55.44 | v147.32,66.67 145.1,66.67 144.46,67.31 144.46,69.53 141.29,72.71 141.29,79.69 R34.2
  Top 0.61: R34.2 Q20.G
  Bottom 0.406: v31.53,80.11 32.91,78.74 48.58,78.74 50.68,76.63 50.68,76.2 52.91,73.97 v53.02,73.97 | v65.74,61.28 v65.75,61.27 v65.75,58.1 | v130.44,55.44 130.48,55.39 136.16,55.39 138.23,57.47 145.58,57.47 U1.18 v147.32,66.67
MOD_11  (via drill 0.4)
  Top 0.406: v131.76,64.45 131.76,67.94 133.67,69.85 135.25,69.85 135.89,69.22 140.97,69.22 142.56,67.63 143.19,67.63 143.83,68.26 143.83,68.9 139.38,73.34 139.38,78.74 138.11,80.01 124.46,80.01 R37.2
  Top 0.61: R37.2 Q22.G
  Bottom 0.406: U1.23 131.76,62.06 v131.76,64.45
MOD_12  (via drill 0.4)
  Top 0.406: v127,64.45 127,65.09 121.6,70.48 118.43,70.48 113.35,75.56 106.85,75.56 v106.68,75.39
  Top 0.61: R47.2 Q24.G
  Bottom 0.406: U1.24 127,64.28 v127,64.45 | v106.68,75.39 R47.2
MOD_13  (via drill 0.4)
  Top 0.406: v125.73,64.45 125.73,65.41 121.28,69.85 118.11,69.85 113.03,74.93 107.95,74.93 107.31,74.3 106.04,74.3 104.77,75.56 98.42,75.56 96.52,77.47 93.98,77.47 93.34,78.11 90.29,78.11 v90.17,77.98
  Top 0.61: R50.2 Q26.G
  Bottom 0.406: U1.25 125.73,63.02 v125.73,64.45 | v90.17,77.98 R50.2
MOD_14  (via drill 0.4)
  Top 0.406: v124.46,64.45 124.46,65.72 120.97,69.22 117.79,69.22 112.71,74.3 108.58,74.3 107.95,73.66 105.41,73.66 104.14,74.93 97.79,74.93 95.88,76.83 93.34,76.83 92.71,77.47 91.44,77.47 90.8,76.83 89.53,76.83 88.27,78.11 78.1,78.11 77.47,78.74 73.78,78.74 v73.66,78.62
  Top 0.61: R53.2 Q28.G
  Bottom 0.406: v124.46,64.45 124.46,61.74 U1.26 | v73.66,78.62 R53.2
MOD_15  (via drill 0.4)
  Top 0.406: v123.19,64.45 123.19,66.04 120.65,68.58 117.47,68.58 112.39,73.66 109.22,73.66 108.58,73.02 104.77,73.02 103.5,74.3 97.16,74.3 95.25,76.2 88.9,76.2 87.63,77.47 77.47,77.47 76.83,78.11 74.22,78.11 73.97,77.86 73.35,77.86 73.1,78.11 72.39,78.11 71.75,78.74 62.23,78.74 61.59,79.38 61.08,79.38 v60.96,79.25
  Top 0.61: R56.2 Q30.G
  Bottom 0.406: U1.27 123.19,60.47 v123.19,64.45 | v60.96,79.25 60.2,80.01 58.42,80.01 R56.2
MOD_16  (via drill 0.4)
  Top 0.406: v121.92,64.45 121.92,66.36 120.33,67.94 117.16,67.94 112.08,73.02 109.85,73.02 109.22,72.39 104.14,72.39 102.87,73.66 90.17,73.66 86.99,76.83 76.2,76.83 75.56,77.47 74.38,77.47 74.21,77.3 73.11,77.3 72.94,77.47 71.75,77.47 71.12,78.11 60.96,78.11 59.69,79.38 46.36,79.38 45.72,80.01 41.91,80.01 R59.2
  Top 0.61: R59.2 Q32.G
  Bottom 0.406: U1.28 v121.92,64.45
N$1
  Top 0.61: R3.1 14.92,11.92 20.47,6.38 DCC_IN.1
N$2
  Top 0.61: R4.1 LED1.A
N$3
  Top 0.61: LED18.A 157.48,42.54 R21.1
N$4
  Top 0.61: R3.2 15.41,19.69 D5.C 17.46,18.1 18.41,17.14 OK1.2
N$5  (via drill 0.5)
  Top 0.61: X2.3 44.43,6.38 40.64,10.16 JP3.3 39.32,14.02 39.32,14.48 37.34,16.46 36.88,16.46 Q3.D | R5.2 v48.26,17.78
  Bottom 0.61: v48.26,17.78 48.11,17.63 39.53,17.63 38.56,16.66 36.68,16.66 Q3.D
N$6  (via drill 0.5)
  Top 0.61: X1.3 60.94,6.38 57.15,10.16 JP1.3 Q5.D | R6.2 v64.77,17.78
  Bottom 0.61: v64.77,17.78 64.62,17.63 56.04,17.63 55.07,16.66 53.19,16.66 Q5.D
N$7
  Top 0.61: R22.1 158.75,60.32 LED19.A
N$8
  Top 0.61: OK1.7 24.13,17.14 22.86,18.41 19.37,18.41 18.73,19.05 18.73,21.27 17.78,22.23 R1.1
N$10
  Top 0.61: R52.2 76.2,82.55 | 76.2,82.55 76.2,86.36 3,3K13.1 | Q29.G 70,85.57 70,82.72 70.66,82.07 71.58,82.07 72.07,82.55 76.2,82.55
N$13
  Top 0.61: R40.1 LED20.A
N$14
  Top 0.61: R6.1 64.77,15.88 LED3.A
N$15  (via drill 0.4, 0.5)
  Top 0.406: v120.02,31.12 117.47,28.57 94.61,28.57 93.34,27.3 83.82,27.3 83.44,27.69 81.66,27.69 80.64,26.67 63.31,26.67 62.96,27.02 61.92,27.02 61.57,26.67 46.13,26.67 v45.72,26.26
  Top 0.61: 3,3K.2 v45.72,18.54
  Bottom 0.406: JP4.2 121.28,29.85 v120.02,31.12 | v45.72,26.26 3,3K.2
  Bottom 0.61: Q3.S 38.86,18.54 v45.72,18.54
N$16
  Top 0.61: R5.1 48.26,15.88 LED2.A
N$17
  Top 0.61: R41.1 158.75,70.48 LED21.A
N$18
  Top 0.61: 3,3K12.1 92.71,86.36 92.71,82.55 | 92.71,82.55 R49.2 | Q27.G 86.51,85.57 86.51,82.72 87.17,82.07 88.09,82.07 88.58,82.55 92.71,82.55
N$19
  Top 0.61: R7.1 57.3,18.9 54.13,18.9 53.8,18.57 52.88,18.57 52.07,19.37 Q4.D
N$20
  Top 0.61: R42.1 158.79,34.88 LED22.A
N$21  (via drill 0.4, 0.5)
  Top 0.406: v120.02,29.85 118.16,27.99 113.75,27.99 113.71,27.94 94.93,27.94 93.66,26.67 83.44,26.67 83.11,26.99 81.92,26.99 80.96,26.04 63.12,26.04 62.89,26.26 v62.23,26.26
  Top 0.61: v62.23,18.54 3,3K1.2
  Bottom 0.406: JP2.2 128.27,29.85 127,28.57 121.28,28.57 v120.02,29.85 | v62.23,26.26 3,3K1.2
  Bottom 0.61: Q5.S 55.37,18.54 v62.23,18.54
N$22  (via drill 0.5)
  Top 0.61: X3.3 79.96,6.35 77.47,6.35 73.66,10.16 JP5.3 Q7.D | R9.2 v81.28,17.78
  Bottom 0.61: v81.28,17.78 81.13,17.63 72.55,17.63 71.58,16.66 69.7,16.66 Q7.D
N$23
  Top 0.61: R9.1 81.28,15.88 LED4.A
N$24  (via drill 0.4)
  Top 0.406: IC1.5 23.49,83.82 28.58,83.82 29.4,82.99 29.4,78.43 30.16,77.67 v30.16,77.47 | v53.02,71.09 53.49,71.09 53.75,71.36 53.89,71.36 53.98,71.44 58.38,71.44 59.69,70.13 59.69,66.67 62.87,63.5 v62.87,61.28 | v62.87,58.1 62.87,54.62 62.87,54.61 66.04,51.43 119.38,51.43 121.6,53.66 122.87,53.66 122.95,53.58 v122.95,53.53
  Bottom 0.406: v30.16,77.47 30.48,77.47 31.12,76.83 47.62,76.83 49.01,75.45 49.01,75 52.71,71.3 52.82,71.3 v53.02,71.09 | v62.87,61.28 v62.87,58.11 v62.87,58.1 | v122.95,53.53 124.75,53.53 U1.3
N$25
  Top 0.61: R44.1 40.79,18.9 37.62,18.9 37.29,18.57 36.37,18.57 35.56,19.37 Q2.D
N$26
  Bottom 0.508: R43.1 8.25,85.09 9.52,83.82 17.78,83.82 19.05,82.55 IC1.4
N$27
  Top 0.406: U$1.3 13.97,95.88 14.61,95.25 14.61,90.17 IC1.13
N$28
  Top 0.61: R55.2 59.69,82.55 | 59.69,82.55 59.69,86.36 3,3K14.1 | Q31.G 53.49,85.57 53.49,82.72 54.15,82.07 55.07,82.07 55.56,82.55 59.69,82.55
N$29
  Top 0.61: R10.1 73.81,18.9 70.64,18.9 70.31,18.57 69.39,18.57 68.58,19.37 Q6.D
N$30  (via drill 0.4, 0.5)
  Top 0.406: v115.57,26.67 115.37,26.67 114.61,27.43 113.99,27.43 113.86,27.3 95.22,27.3 93.95,26.04 83.12,26.04 82.92,26.23 v82.55,26.23
  Top 0.61: v78.74,18.54 3,3K2.2
  Bottom 0.406: JP6.2 131.25,29.85 129.98,28.57 127.83,28.57 127.02,27.77 127.02,26.89 126.17,26.04 116.2,26.04 v115.57,26.67 | v82.55,26.23 80.84,26.23 3,3K2.2
  Bottom 0.61: Q7.S 71.88,18.54 v78.74,18.54
N$31  (via drill 0.5)
  Top 0.61: X4.3 93.95,6.38 90.17,10.16 JP7.3 Q9.D | R12.2 v97.79,17.78
  Bottom 0.61: v97.79,17.78 97.64,17.63 89.06,17.63 88.09,16.66 86.21,16.66 Q9.D
N$32  (via drill 0.4)
  Top 0.406: IC1.6 26.03,80.01 28.21,80.01 28.84,79.38 28.84,77.71 29.85,76.71 29.96,76.71 v30.16,76.51 | v53.02,70.14 53.22,70.34 53.52,70.34 53.98,70.8 58.11,70.8 59.05,69.85 59.05,66.36 61.91,63.51 v61.91,61.28 | v61.91,58.05 61.91,54.61 65.72,50.8 119.57,50.8 121.09,52.32 121.33,52.32 v121.94,52.9
  Bottom 0.406: v30.16,76.51 30.65,76.51 30.88,76.28 31.04,76.28 31.12,76.2 47.31,76.2 48.43,75.08 48.43,74.61 52.71,70.34 52.82,70.34 v53.02,70.14 | v61.91,61.28 v61.91,61.27 v61.91,58.05 | v121.94,52.9 122.51,52.9 122.64,52.77 122.97,52.77 U1.2
N$33
  Top 0.406: U$1.2 14.62,96.5 15.24,95.88 15.24,90.8 IC1.12
N$34
  Top 0.61: R12.1 97.79,15.88 LED5.A
N$35
  Top 0.61: Q33.G 36.83,82.87 37.64,82.07 39.83,82.07 40.16,82.4 43.18,82.4 | R58.2 43.18,82.4 | 3,3K15.1 43.18,86.36 43.18,82.4
N$36
  Top 0.61: R13.1 90.32,18.9 87.15,18.9 86.82,18.57 85.9,18.57 85.09,19.37 Q8.D
N$37
  Top 0.61: IC1.14 11.73,89.53 13.51,87.76 16.97,87.76 18.75,89.53 IC1.11 C12.2
N$38
  Top 0.61: PRG_HEADER.2 29.21,95.88 D19.A
N$39  (via drill 0.4, 0.5)
  Top 0.406: v114.3,26.67 95.66,26.67 v95.25,26.26
  Top 0.61: v95.25,18.54 3,3K3.2
  Bottom 0.406: JP8.2 134.62,27.94 134.62,26.67 133.99,26.04 127,26.04 126.36,25.4 115.57,25.4 v114.3,26.67 | v95.25,26.26 3,3K3.2
  Bottom 0.61: Q9.S 88.39,18.54 v95.25,18.54
N$40  (via drill 0.5)
  Top 0.61: X5.3 110.46,6.38 106.68,10.16 JP9.3 Q11.D | R15.2 v114.3,17.78
  Bottom 0.61: v114.3,17.78 114.15,17.63 105.57,17.63 104.6,16.66 102.72,16.66 Q11.D
N$41
  Top 0.61: R15.1 114.3,15.88 LED6.A
N$43
  Top 0.61: R16.1 106.83,18.9 103.66,18.9 103.33,18.57 102.41,18.57 101.6,19.37 Q10.D
N$44  (via drill 0.4, 0.5)
  Top 0.406: v138.42,28.89 139.37,29.85 JP10.2
  Top 0.61: v111.76,18.54 3,3K4.2
  Bottom 0.406: v138.42,28.89 138.43,28.88 138.43,26.04 137.79,25.4 127.63,25.4 127,24.77 127,23.5 126.36,22.86 121.45,22.86 121.07,23.24 120.23,23.24 120.1,23.11 118.66,23.11 118.53,23.24 117.69,23.24 117.31,22.86 113.03,22.86 3,3K4.2
  Bottom 0.61: Q11.S 104.9,18.54 v111.76,18.54
N$45  (via drill 0.5)
  Top 0.61: X6.3 126.97,6.38 123.19,10.16 JP11.3 Q13.D | R18.2 v130.81,17.78
  Bottom 0.61: v130.81,17.78 122.23,17.78 121.11,16.66 119.23,16.66 Q13.D
N$46
  Top 0.61: R18.1 130.81,15.88 LED7.A
N$48
  Top 0.61: R19.1 124.77,16.51 122.38,18.9 120.17,18.9 119.84,18.57 118.92,18.57 118.11,19.37 Q12.D
N$49
  Top 0.61: OK1.3 18.73,14.61 17.46,13.34 D5.A 21.27,8.25 26.99,8.25 DCC_IN.2
N$50  (via drill 0.4, 0.5)
  Top 0.406: JP12.2 147.32,29.85 146.05,28.57 140.34,28.57 140.33,28.59 v140.33,28.62
  Top 0.61: v128.27,18.69 3,3K5.2
  Bottom 0.406: 3,3K5.2 129.54,22.86 133.82,22.86 134.2,23.24 135.04,23.24 135.17,23.11 136.61,23.11 136.74,23.24 137.58,23.24 137.96,22.86 140.34,22.86 140.97,23.5 140.97,24.77 140.33,25.41 v140.33,28.62
  Bottom 0.61: Q13.S 121.56,18.69 v128.27,18.69
N$51  (via drill 0.5)
  Top 0.61: X7.3 143.48,6.38 139.7,10.16 JP13.3 Q15.D | R23.2 v147.32,17.78
  Bottom 0.61: Q15.D 135.74,16.66 137.64,16.66 138.75,17.78 v147.32,17.78
N$52
  Top 0.61: R23.1 147.32,15.88 LED8.A
N$53
  Top 0.61: R19.2 125.73,19.69 | 125.73,19.69 125.73,19.05 3,3K5.1 | Q13.G 125.73,19.69
N$54
  Top 0.61: R24.1 141.28,16.51 138.89,18.9 136.68,18.9 136.35,18.57 135.43,18.57 134.62,19.37 Q14.D
N$55  (via drill 0.5)
  Top 0.61: 3,3K6.2 v144.78,18.69
  Bottom 0.406: JP14.2 153.67,27.94 153.67,26.04 153.03,25.4 151.13,25.4 148.59,22.86 146.05,22.86 3,3K6.2
  Bottom 0.61: Q15.S 138.07,18.69 v144.78,18.69
N$56  (via drill 0.5)
  Top 0.61: X8.3 160,6.38 156.21,10.16 JP15.3 Q17.D | R26.2 v163.83,17.78
  Bottom 0.61: v163.83,17.78 155.25,17.78 154.13,16.66 152.25,16.66 Q17.D
N$57
  Top 0.61: R26.1 163.83,15.88 LED9.A
N$58
  Top 0.61: R16.2 109.22,19.69 | 109.22,19.69 109.22,19.05 3,3K4.1 | Q11.G 109.22,19.69
N$59
  Top 0.61: Q16.D 151.13,19.37 151.94,18.57 152.88,18.57 153.21,18.9 155.4,18.9 157.79,16.51 R27.1
N$60  (via drill 0.5)
  Top 0.406: JP16.2 157.82,27.6 157.82,27.14 159.85,25.11 160.31,25.11 3,3K7.2
  Top 0.61: 3,3K7.2 v161.29,18.69
  Bottom 0.61: Q17.S 154.58,18.69 v161.29,18.69
N$61  (via drill 0.5)
  Top 0.61: R29.2 v163.83,87.63 | JP17.3 151.13,97.74 X9.3
  Bottom 0.61: JP17.3 151.13,90.17 Q19.D v163.83,87.63
N$62
  Top 0.61: R29.1 163.83,89.53 LED10.A
N$63
  Top 0.61: 3,3K3.1 92.71,19.05 92.71,19.69 | 92.71,19.69 R13.2 | Q9.G 92.71,19.69
N$64
  Top 0.61: Q18.D 157.48,86.99 157.48,87.63 R30.1
N$65  (via drill 0.5)
  Top 0.406: JP18.2 157.82,77.81 157.82,78.27 159.85,80.3 160.31,80.3 3,3K8.2
  Top 0.61: 3,3K8.2 v161.29,86.72
  Bottom 0.61: v161.29,86.72 154.34,86.72 154.13,86.51 153.19,86.51 152.86,86.84 151.92,86.84 Q19.S
N$66  (via drill 0.5)
  Top 0.61: v147.32,87.63 R32.2 | JP19.3 134.62,97.74 X10.3
  Bottom 0.61: JP19.3 134.62,90.17 Q21.D v147.32,87.63
N$67
  Top 0.61: R32.1 147.32,89.53 LED11.A
N$68
  Top 0.61: R36.2 125.73,82.55 | 125.73,82.55 125.73,86.36 3,3K10.1 | Q23.G 119.53,85.57 119.53,82.72 120.19,82.07 121.11,82.07 121.6,82.55 125.73,82.55
N$69
  Top 0.61: Q20.D 140.97,86.99 140.97,87.63 R33.1
N$70  (via drill 0.5)
  Top 0.61: 3,3K9.2 v144.78,86.72
  Bottom 0.406: JP20.2 153.67,77.47 153.67,79.38 152.78,80.26 146.9,80.26 145.88,81.28 3,3K9.2
  Bottom 0.61: Q21.S 135.58,87.63 136.7,86.51 137.62,86.51 137.83,86.72 v144.78,86.72
N$71  (via drill 0.5)
  Top 0.61: R35.2 v130.81,87.63 | JP21.3 118.11,97.74 X11.3
  Bottom 0.61: JP21.3 118.11,90.17 Q23.D v130.81,87.63
N$72
  Top 0.61: R35.1 130.81,89.53 LED12.A
N$73
  Top 0.61: R10.2 76.2,19.69 | 76.2,19.69 76.2,19.05 3,3K2.1 | Q7.G 76.2,19.69
N$74
  Top 0.61: Q22.D 124.46,86.99 124.46,87.63 R36.1
N$75  (via drill 0.5)
  Top 0.61: 3,3K10.2 v128.27,86.72
  Bottom 0.406: JP22.2 149.86,77.47 149.86,78.74 149.22,79.38 146.69,79.38 146.05,80.01 144.14,80.01 143.51,80.64 143.51,81.91 142.88,82.55 137.96,82.55 137.58,82.17 136.74,82.17 136.61,82.3 135.17,82.3 135.04,82.17 134.2,82.17 134.07,82.3 129.29,82.3 3,3K10.2
  Bottom 0.61: Q23.S 119.07,87.63 120.19,86.51 121.11,86.51 121.32,86.72 v128.27,86.72
N$76  (via drill 0.5)
  Top 0.61: v114.3,87.63 R38.2 | JP23.3 101.6,97.74 X12.3
  Bottom 0.61: JP23.3 101.6,90.17 Q25.D v114.3,87.63
N$77
  Top 0.61: R38.1 114.3,89.53 LED13.A
N$78
  Top 0.61: 3,3K1.1 59.69,19.05 59.69,19.69 | 59.69,19.69 R7.2 | Q5.G 59.69,19.69
N$79
  Top 0.61: Q24.D 107.95,86.99 107.95,87.63 R45.1
N$80  (via drill 0.5)
  Top 0.61: 3,3K11.2 v111.76,86.72
  Bottom 0.406: JP24.2 146.05,77.47 146.05,78.74 145.41,79.38 143.51,79.38 142.88,80.01 127.63,80.01 127,80.64 127,81.91 126.36,82.55 121.45,82.55 121.07,82.17 120.23,82.17 120.1,82.3 118.66,82.3 118.53,82.17 117.69,82.17 117.31,82.55 113.03,82.55 3,3K11.2
  Bottom 0.61: v111.76,86.72 104.81,86.72 104.6,86.51 103.66,86.51 103.33,86.84 103.02,86.84 102.23,87.63 Q25.S
N$81  (via drill 0.5)
  Top 0.61: R48.2 v97.79,87.63 | JP25.3 85.09,97.74 X13.3
  Bottom 0.61: JP25.3 85.09,90.17 Q27.D v97.79,87.63
N$82
  Top 0.61: R48.1 97.79,89.53 LED14.A
N$84
  Top 0.61: Q26.D 91.44,86.99 91.44,87.63 R49.1
N$85  (via drill 0.4, 0.5)
  Top 0.406: v120.65,73.93 118.43,73.93 114.25,78.11 100.96,78.11 99.06,80.01 96.52,80.01 3,3K12.2
  Top 0.61: 3,3K12.2 v95.25,86.72
  Bottom 0.406: JP26.2 134.59,77.49 134.59,78.57 133.79,79.38 127,79.38 126.36,80.01 123.51,80.01 122.55,79.06 122.55,77.47 121.92,76.83 121.92,75.2 v120.65,73.93
  Bottom 0.61: Q27.S 86.05,87.63 87.17,86.51 88.09,86.51 88.3,86.72 v95.25,86.72
N$86  (via drill 0.5)
  Top 0.61: v81.28,87.63 R51.2 | JP27.3 68.58,97.74 X14.3
  Bottom 0.61: JP27.3 68.58,90.17 Q29.D v81.28,87.63
N$87
  Top 0.61: R51.1 81.28,89.53 LED15.A
N$89
  Top 0.61: Q28.D 74.93,86.99 74.93,87.63 R52.1
N$90  (via drill 0.4, 0.5)
  Top 0.406: 3,3K13.2 80.01,80.01 95.25,80.01 95.88,79.38 98.42,79.38 100.33,77.47 113.98,77.47 118.43,73.02 120.65,73.02 120.79,73.16 v121.55,73.16
  Top 0.61: 3,3K13.2 v78.74,86.72
  Bottom 0.406: JP28.2 131.44,76.83 127.63,76.83 126.99,77.48 126.99,78.6 | 127,78.58 126.99,78.6 | 126.99,78.6 126.21,79.38 123.82,79.38 123.19,78.74 123.19,77.15 122.55,76.52 122.55,74.93 121.55,73.93 v121.55,73.16
  Bottom 0.61: v78.74,86.72 71.79,86.72 71.58,86.51 70.64,86.51 69.53,87.63 Q29.S
N$91  (via drill 0.5)
  Top 0.61: R54.2 v64.77,87.63 | JP29.3 52.07,97.74 X15.3
  Bottom 0.61: JP29.3 52.07,90.17 Q31.D v64.77,87.63
N$92
  Top 0.61: R54.1 64.77,89.53 LED16.A
N$94
  Top 0.61: Q30.D 58.42,86.99 58.42,87.63 R55.1
N$95  (via drill 0.4, 0.5)
  Top 0.406: 3,3K14.2 63.5,80.01 78.74,80.01 79.38,79.38 94.61,79.38 95.25,78.74 97.79,78.74 99.69,76.83 113.82,76.83 118.27,72.39 v122.19,72.39
  Top 0.61: 3,3K14.2 v62.23,86.72
  Bottom 0.406: JP30.2 127.63,75.56 126.36,76.83 123.82,76.83 123.19,76.2 123.19,74.61 122.53,73.95 122.53,72.73 v122.19,72.39
  Bottom 0.61: v62.23,86.72 55.28,86.72 55.07,86.51 54.13,86.51 53.02,87.63 Q31.S
N$96  (via drill 0.5)
  Top 0.61: v48.26,87.63 R57.2 | JP31.3 35.56,97.74 X16.3
  Bottom 0.61: JP31.3 35.56,90.17 Q33.D v48.26,87.63
N$97
  Top 0.61: R57.1 48.26,89.53 LED17.A
N$99
  Top 0.61: R58.1 41.91,87.63 41.91,86.99 Q32.D
N$100  (via drill 0.4, 0.5)
  Top 0.406: 3,3K15.2 46.99,80.01 62.23,80.01 62.87,79.38 78.1,79.38 78.74,78.74 93.98,78.74 94.61,78.11 97.16,78.11 99.06,76.2 113.66,76.2 118.74,71.12 v122.19,71.12
  Top 0.61: 3,3K15.2 v45.72,86.72
  Bottom 0.406: JP32.2 123.14,73.61 123.14,72.07 v122.19,71.12
  Bottom 0.61: Q33.S 36.52,87.63 37.64,86.51 38.56,86.51 38.77,86.72 v45.72,86.72
N$101
  Top 0.61: R33.2 142.24,82.55 | 142.24,82.55 142.24,86.36 3,3K9.1 | Q21.G 136.04,85.57 136.04,82.72 136.7,82.07 137.62,82.07 138.11,82.55 142.24,82.55
N$102
  Top 0.61: R45.2 109.22,82.55 | 109.22,82.55 109.22,86.36 3,3K11.1 | Q25.G 103.02,85.57 103.02,82.72 103.68,82.07 104.6,82.07 105.09,82.55 109.22,82.55
N$103
  Top 0.61: R30.2 158.75,82.55 | 158.75,82.55 158.75,86.36 3,3K8.1 | Q19.G 152.55,85.57 152.55,82.72 153.21,82.07 154.13,82.07 154.62,82.55 158.75,82.55
N$104
  Top 0.61: 3,3K7.1 158.75,19.05 158.75,19.69 | 158.75,19.69 R27.2 | Q17.G 158.75,19.69
N$105
  Top 0.61: 3,3K6.1 142.24,19.05 142.24,19.69 | 142.24,19.69 R24.2 | Q15.G 142.24,19.69
N$106
  Top 0.61: 43.18,19.69 43.18,19.05 3,3K.1 | 43.18,19.69 R44.2 | Q3.G 43.18,19.69
POWER_IN+
  Top 4.064: 14.61,52.7 11.43,55.88 D13.C D12.A | 14.61,52.7 17.78,49.53 17.78,42.54 D3.A D4.C 9.4,27.81 9.4,13.78 POWER_IN.2 | 14.61,52.7 53.98,52.7 | 53.98,52.7 55.88,54.61 D17.C D16.A | 53.98,52.7 53.47,52.2 53.39,52.2 51.45,50.27 51.45,41.17 55.88,36.74 D6.A D7.C
POWER_IN-
  Bottom 4.064: POWER_IN.1 9.4,8.7 9.4,23.87 11.43,25.9 14.47,25.9 17.78,29.21 17.78,36.2 D2.C D1.A 11.43,50.71 13.92,53.21 | D9.C D8.A 55.88,50.7 53.87,52.7 | 13.92,53.21 15.86,55.14 15.86,64.23 11.43,68.67 D11.C D10.A | 53.87,52.7 51.45,55.13 51.45,64.23 55.88,68.67 D15.C 55.88,70.8 55.88,73.66 D14.A | 13.92,53.21 14.43,52.7 53.87,52.7
QUARTZ_1
  Top 0.61: U1.9 142.24,49.4 Q1.2 139.06,46.23 C15.2
QUARTZ_2
  Top 0.61: C14.2 146.69,46.23 Q1.1 144.78,48.13 U1.10
RESET  (via drill 0.4)
  Top 0.406: PRG_HEADER.5 27.94,99.69 27.94,93.34 30.48,90.8 30.48,81.61 30.1,81.23 30.1,79.12 30.16,79.05 v30.16,78.74 | v63.82,61.28 63.82,63.5 60.33,66.99 60.33,70.28 58.53,72.07 53.04,72.07 v53.02,72.05 | v63.83,58.1 63.83,54.62 63.82,54.61 66.36,52.07 119.06,52.07 121.28,54.29 128.87,54.29 v129.05,54.12 | v138.75,53.97 148.27,53.97 v148.59,53.66
  Bottom 0.406: v30.16,78.74 31.43,77.47 47.94,77.47 49.57,75.85 49.57,75.4 52.91,72.05 v53.02,72.05 | v63.82,61.28 v63.82,58.11 v63.83,58.1 | v148.59,53.66 148.59,50.78 149.86,49.51 149.86,48.89 C10.1 | v129.05,54.12 129.13,54.03 138.69,54.03 v138.75,53.97
RESET_MC  (1 unrouted)
  Top 0.61: C10.2 156.21,48.26 | U1.1 123.34,52.7 134.81,52.7 135.89,51.62 135.89,50.67 136.54,50.02 137.78,50.02 138.43,50.67 138.43,51.62 139.51,52.7 155.78,52.7 156.21,52.27 156.21,49.53 | 156.21,49.53 156.21,48.26 | S1.1 156.29,49.45 156.21,49.53 | R39.2 157.16,46.04 157.16,47.31 156.21,48.26
SCK  (via drill 0.4)
  Top 0.406: PRG_HEADER.7 26.03,102.87 32.38,102.87 34.29,100.97 34.29,91.44 32.38,89.53 32.38,80.86 v32.26,80.74 | v53.03,74.93 53.23,74.73 53.34,74.73 54.09,73.98 59.37,73.98 62.23,71.12 62.23,67.94 66.7,63.47 v66.7,61.28 | v66.71,58.1 66.71,55.21 67.31,54.61 118.74,54.61 120.33,56.2 131.03,56.2 v131.08,56.15
  Top 0.61: U1.19 144.78,62.23 146.69,64.14 149.22,64.14 149.86,64.77 149.86,66.67 R41.2
  Bottom 0.406: v32.26,80.74 33.63,79.38 48.87,79.38 51.27,76.97 51.27,76.52 52.86,74.93 v53.03,74.93 | v66.7,61.28 v66.7,58.11 v66.71,58.1 | U1.19 143.68,58.1 138.08,58.1 136.12,56.15 v131.08,56.15

## Text on the board
tPlace: USB-Serial | Programmer | SIG | 5V | GND | SIG | 5V | GND | SIG | 5V | GND | SIG | 5V | GND | SIG | 5V | GND | SIG | 5V | GND | SIG | 5V | GND | SIG | 5V | GND | M3.5 | SIG | 5V | GND | SIG | 5V | GND | SIG | 5V | GND | SIG | 5V | GND | SIG | 5V | GND | SIG | 5V | GND | SIG | 5V | GND | SIG | 5V | GND | SIG | 5V | GND | SIG | 5V | GND | SIG | 5V | GND | SIG | 5V | GND | SIG | 5V | GND | SIG | 5V | GND | SIG | 5V | GND | SIG | 5V | GND | 10 - 24V | 16 | 15 | 14 | 13 | 12 | 11 | 10 | 9 | M3.5 | --- | 5V | --- Outputs --- | Out 16 | Out 15 | Out 14 | Out 13 | Out 12 | Out 11 | Out 10 | Out 9 | PWR / Logic | M3.5 | PWR Logic | PWR 3 | PWR 3 | DCC Decoder for Servo- / and Lightapplications | For use with MARDEC and / ARSIGDEC Software | Ver. 1.0THT | Reset | PWR 1 | PWR 2 | PWR 2 | M3.5 | PWR 1 | DCC Signal / Activity | Out 1 | Out 2 | Out 3 | Out 4 | Out 5 | Out 6 | Out 7 | Out 8 | --- Outputs --- | 5V | --- | 16 | 2 | 3 | 4 | 5 | 6 | 7 | 8 | M3.5 | 10 - 24V | Special Thanks to / André Ryll | 3.3k | C. S. | GND | 5V | SIG | GND | 5V | SIG | GND | 5V | SIG | GND | 5V | SIG | GND | 5V | SIG | GND | 5V | SIG | GND | 5V | SIG | GND | 5V | SIG | GND | 5V | SIG | GND | GND | 5V | 5V | SIG | SIG | GND | GND | 5V | 5V | SIG | SIG | GND | GND | 5V | 5V | SIG | SIG | GND | GND | 5V | 5V | SIG | SIG | GND | GND | 5V | 5V | SIG | SIG | GND | GND | 5V | 5V | SIG | SIG | GND | 5V | SIG | M3.5 | 10-24V =~ | DCC in | GND | 5V | SIG | GND | 5V | SIG | GND | 5V | SIG | GND | 5V | SIG | GND | 5V | SIG | GND | 5V | SIG | GND | 5V | SIG | GND | 5V | SIG
tNames: MISO | SCK | RST | --- | MOSI | GND | GND | GND | GND | 5V | STATUS